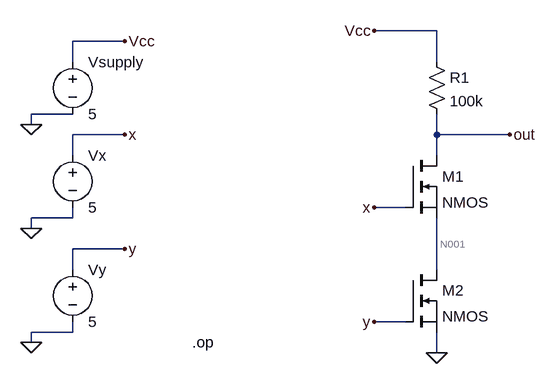
[diagram p0: schematic Task01.asc]
Task01.asc, the LTspice schematic file:
Version 4
SHEET 1 880 680
WIRE 304 -80 208 -80
WIRE -176 -64 -256 -64
WIRE -256 -32 -256 -64
WIRE 304 -32 304 -80
WIRE -256 48 -320 48
WIRE -320 64 -320 48
WIRE -176 80 -256 80
WIRE 304 80 304 48
WIRE 416 80 304 80
WIRE -256 112 -256 80
WIRE 304 112 304 80
WIRE 256 192 208 192
WIRE -256 208 -256 192
WIRE -256 208 -320 208
WIRE -320 224 -320 208
WIRE -176 256 -256 256
WIRE -256 288 -256 256
WIRE 304 288 304 208
WIRE 256 368 208 368
WIRE -256 384 -256 368
WIRE -256 384 -320 384
WIRE -320 400 -320 384
WIRE 304 416 304 384
FLAG -320 64 0
FLAG -320 224 0
FLAG -320 400 0
FLAG 304 416 0
FLAG -176 -64 Vcc
FLAG 208 -80 Vcc
FLAG -176 80 x
FLAG 208 192 x
FLAG -176 256 y
FLAG 208 368 y
FLAG 416 80 out
SYMBOL nmos 256 112 R0
SYMATTR InstName M1
SYMBOL nmos 256 288 R0
SYMATTR InstName M2
SYMBOL res 288 -48 R0
SYMATTR InstName R1
SYMATTR Value 100k
SYMBOL voltage -256 -48 R0
SYMATTR InstName Vsupply
SYMATTR Value 5
SYMBOL voltage -256 96 R0
SYMATTR InstName Vx
SYMATTR Value 5
SYMBOL voltage -256 272 R0
SYMATTR InstName Vy
SYMATTR Value 5
TEXT -72 400 Left 2 !.op

The netlist it stands for:
* Task01.asc
M1 out x N001 N001 NMOS
M2 N001 y 0 0 NMOS
R1 Vcc out 100k
Vsupply Vcc 0 5
Vx x 0 5
Vy y 0 5
.model NMOS NMOS
.model PMOS PMOS
.lib standard.mos
.op
.backanno
.end

* Results of the author's LTspice run, read from the files saved beside the schematic
* Operating Point:
*   V(out) = 901 mV
*   V(x) = 5 V
*   V(n001) = 428.2 mV
*   V(y) = 5 V
*   V(vcc) = 5 V
*   Id(M2) = 40.99 µA
*   Ig(M2) = 0 A
*   Ib(M2) = -438.2 fA
*   Is(M2) = -40.99 µA
*   Id(M1) = 40.99 µA
*   Ig(M1) = 0 A
*   Ib(M1) = -482.7 fA
*   Is(M1) = -40.99 µA
*   I(R1) = 40.99 µA
*   I(Vy) = 0 A
*   I(Vx) = 0 A
*   I(Vsupply) = -40.99 µA
* From the log:
*   Semiconductor Device Operating Points:
*                           --- MOSFET Transistors ---
*   Name:          m2          m1
*   Model:        nmos        nmos
*   Id:          4.10e-05    4.10e-05
*   Vgs:         5.00e+00    4.57e+00
*   Vds:         4.28e-01    4.73e-01
*   Vbs:         0.00e+00    0.00e+00
*   Vth:         0.00e+00    0.00e+00
*   Vdsat:       5.00e+00    4.57e+00
*   Gm:          8.56e-06    9.45e-06
*   Gds:         9.14e-05    8.20e-05
*   Gmb:         0.00e+00    0.00e+00
*   Cbd:         0.00e+00    0.00e+00
*   Cbs:         0.00e+00    0.00e+00
*   Cgsov:       0.00e+00    0.00e+00
*   Cgdov:       0.00e+00    0.00e+00
*   Cgbov:       0.00e+00    0.00e+00
*   Cgs:         0.00e+00    0.00e+00
*   Cgd:         0.00e+00    0.00e+00
*   Cgb:         0.00e+00    0.00e+00